# EAGLE board Patriot_78421-B (EAGLE 5.11), part 1 of 3
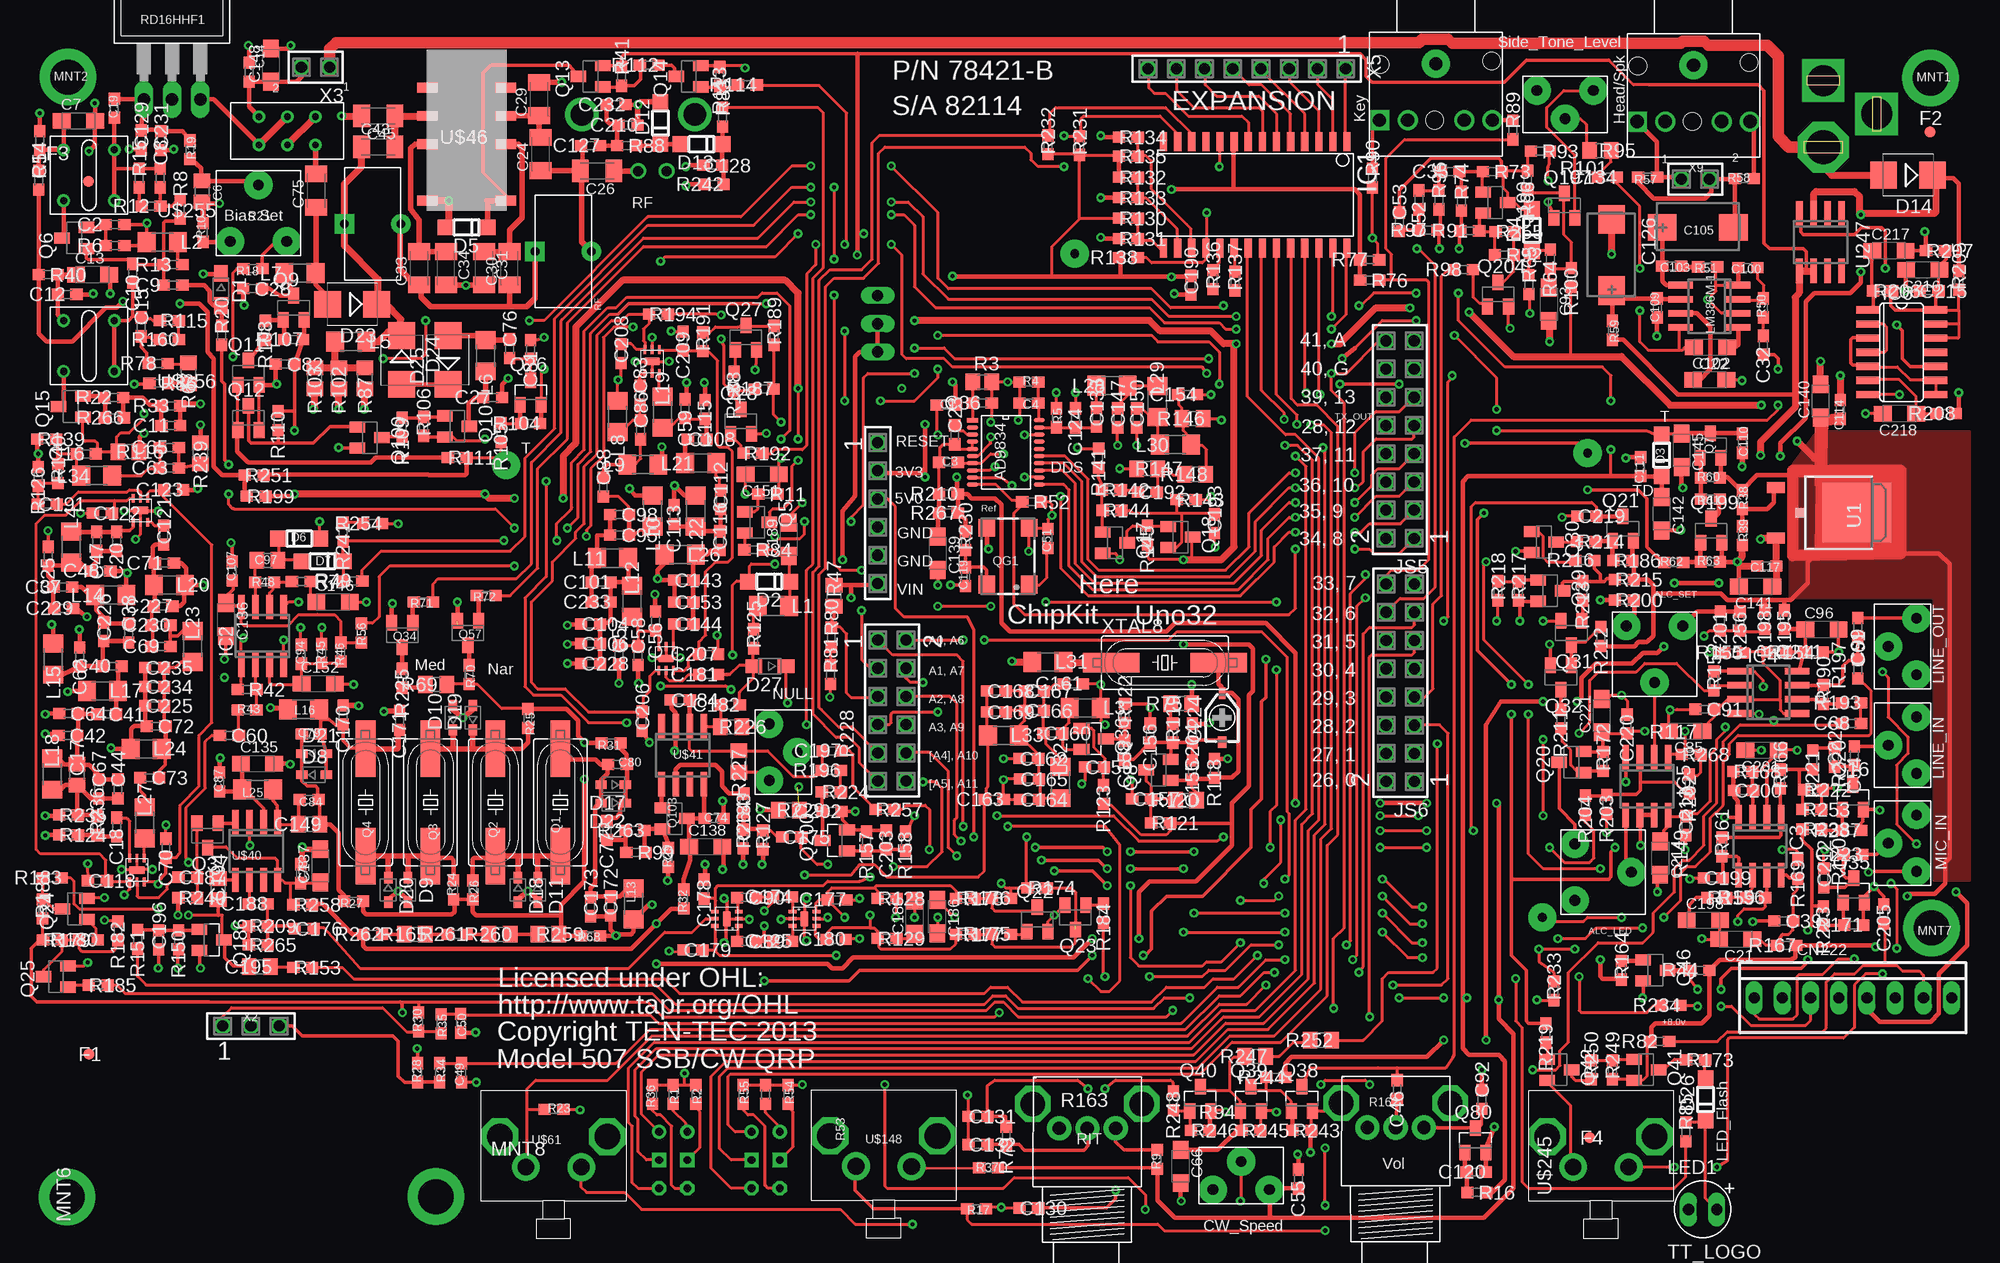
[diagram p2: board, top side]
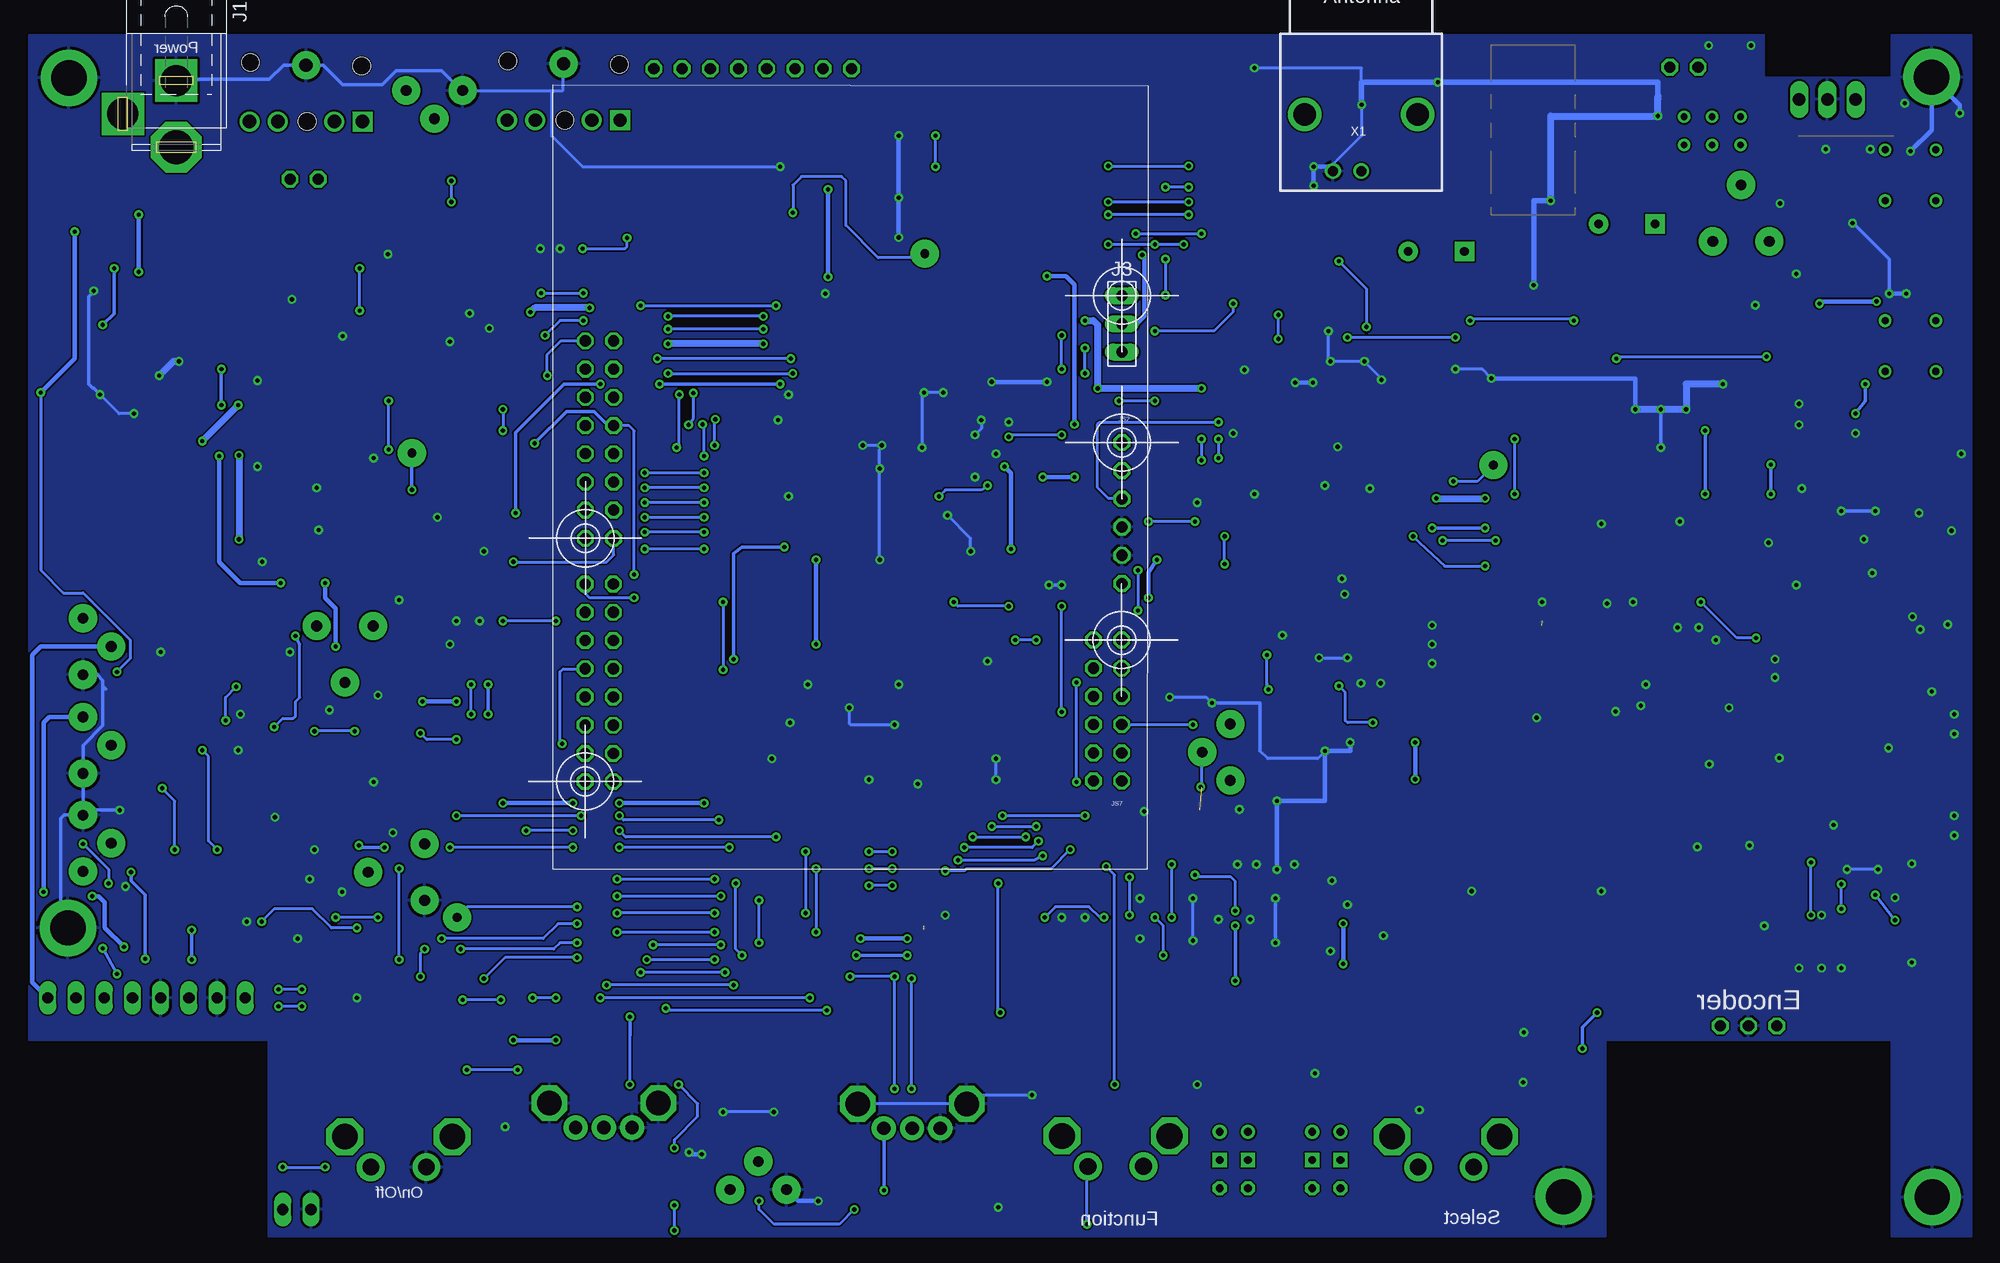
[diagram p3: board, bottom side, seen from below]

No outline drawn. Coordinates in mm, seen from the top.
Copper layers (1*16): Top 0.035mm / dielectric 1.5mm / Bottom 0.035mm
Design rules "default *": minimum track width 10mil, minimum drill 12mil, track to track 6mil, track to pad 6mil, pad to pad 6mil, via to via 6mil, smd to smd 6mil, copper to edge 6mil, drill to drill 8mil, minimum pad ring 10mil, minimum via ring 8mil, stop-mask expansion 4mil, vias tented up to drill 16mil, thermal gap 10mil

## Footprints (pad centres in the part's own frame; a part is rotated, then mirrored left to right if it is on the bottom)
0603 = smd 1.1 x 1: 1 -0.85,0; 2 0.85,0
0805 = smd 1.3 x 1.5: 1 -0.95,0; 2 0.95,0
SMC_A = smd 1.6 x 1.4: + -1.5,0; - 1.5,0
C1206K = smd 1.5 x 2: 1 -1.5,0; 2 1.5,0
POL-7343 = smd 2.6 x 2.4: + 3.2,0; - -3.2,0
CTRIMCTZ3 = smd 0.6 x 1.016: 1 0,2.204 | smd 0.78 x 1.016: 2 0,-2.204
MT8 = drill 1 long: 1 7.62,0; 2 5.08,0; 3 2.54,0; 4 0,0; 5 -2.54,0; 6 -5.08,0; 7 -7.62,0; 8 -10.16,0
SOD323-W = smd 1.5 x 1.2: A 1.45,0; C -1.45,0
SOD123 = smd 1.4 x 1.4: A 1.9,0; C -1.9,0
SOD323-R = smd 1.016 x 0.762: A 1.1,0; C -1.1,0
SMB = smd 2.4 x 2.4: A 2.2,0; C -2.2,0
FIDUCIAL-1MM = smd 1 x 1: FID 0,0
SO28W = smd 0.65 x 1.7: 1 -7.62,-4.78; 2 -6.35,-4.78; 3 -5.08,-4.78; 4 -3.81,-4.78; 5 -2.54,-4.78; 6 -1.27,-4.78; 7 0,-4.78; 8 1.27,-4.78; 9 2.54,-4.78; 10 3.81,-4.78; 11 5.08,-4.78; 12 6.35,-4.78; 13 7.62,-4.78; 14 8.89,-4.78; 15 8.89,4.78; 16 7.62,4.78; 17 6.35,4.78; 18 5.08,4.78; 19 3.81,4.78; 20 2.54,4.78; 21 1.27,4.78; 22 0,4.78; 23 -1.27,4.78; 24 -2.54,4.78; 25 -3.81,4.78; 26 -5.08,4.78; 27 -6.35,4.78; 28 -7.62,4.78
SO08 = smd 0.6 x 2.2: 1 -1.905,-2.6; 2 -0.635,-2.6; 3 0.635,-2.6; 4 1.905,-2.6; 5 1.905,2.6; 6 0.635,2.6; 7 -0.635,2.6; 8 -1.905,2.6
SO14 = smd 0.66 x 2.032: 1 -3.81,-3.073; 2 -2.54,-3.073; 3 -1.27,-3.073; 4 0,-3.073; 5 1.27,-3.073; 6 2.54,-3.073; 7 3.81,-3.073; 8 3.81,3.073; 9 2.54,3.073; 10 1.27,3.073; 11 0,3.073; 12 -1.27,3.073; 13 -2.54,3.073; 14 -3.81,3.073
SPC4077 = drill 2.794 pad 3.81 square: 1 -3,0 | drill 2.8 pad 3.81 square: 2 0,-4.8 | drill 3.048 pad 4.572 octagon: 3 3,0
SOCKET-1X3-.1IN = drill 1.016 long: 1 -2.54,0; 2 0,0; 3 2.54,0
SSW-106-02-S-S = drill 1 pad 1.5 octagon: 1 -6.35,0; 2 -3.81,0; 3 -1.27,0; 4 1.27,0; 5 3.81,0; 6 6.35,0
SSW-108-02-S-D = drill 1 pad 1.5 octagon: 1 -8.89,-1.27; 2 -8.89,1.27; 3 -6.35,-1.27; 4 -6.35,1.27; 5 -3.81,-1.27; 6 -3.81,1.27; 7 -1.27,-1.27; 8 -1.27,1.27; 9 1.27,-1.27; 10 1.27,1.27; 11 3.81,-1.27; 12 3.81,1.27; 13 6.35,-1.27; 14 6.35,1.27; 15 8.89,-1.27; 16 8.89,1.27
SSW-106-02-S-D = drill 1 pad 1.5 octagon: 1 -6.35,-1.27; 2 -6.35,1.27; 3 -3.81,-1.27; 4 -3.81,1.27; 5 -1.27,-1.27; 6 -1.27,1.27; 7 1.27,-1.27; 8 1.27,1.27; 9 3.81,-1.27; 10 3.81,1.27; 11 6.35,-1.27; 12 6.35,1.27
1206 = smd 1.6 x 1.8: 1 -1.4,0; 2 1.4,0
LED-.1IN = drill 1.016 long: A 1.27,0; C -1.27,0
MOUNTINGHOLE-.125IN = drill 3.175 pad 5.08 round: MNT 0,0
PAD = drill 0.8 pad 2.54 round: P$1 0,0
SM49 = smd 5.08 x 1.778: 1 -4.826,0; 2 4.826,0
MIKE_SOT23 = smd 1 x 1.4: 1 -0.95,-1.1; 2 0.95,-1.1; 3 0,1.1
SOT23 = smd 1 x 1.4: 1 -0.95,-1.1; 2 0.95,-1.1; 3 0,1.1
SOT-23 = smd 1 x 1.4: 1 -0.95,-1.1; 2 0.95,-1.1; 3 0,1.1
CRYSTAL_SM77H = smd 1.6 x 1.5: 1 -2.55,-1.9; 2 2.55,-1.9; 3 2.55,1.9; 4 -2.55,1.9
R0805 = smd 1.3 x 1.5: 1 -0.85,0; 2 0.85,0
RVM-06-HP03-1 = drill 0.965 pad 2.54 round: 1 -2.54,-2.54; 2 0,2.54; 3 2.54,-2.54
RVM-06-VP01-1 = drill 0.965 pad 2.54 round: 1 -2.54,-1.27; 2 0,1.27; 3 2.54,-1.27
3RP/1610N = drill 1.2 pad 2.184 round: 1 -2.54,0; 2 0,0; 3 2.54,0 | drill 2.2 pad 3 octagon: 4 -4.91,2.2; 5 4.89,2.2
TO-220S = drill 1.118 long: 1 -3.81,-10.16; 2 -1.27,-10.16; 3 1.27,-10.16
TOROID = drill 0.8 pad 1.778 square: P$1 0,-2.54 | drill 0.8 pad 1.778 round: P$2 0,2.54
TO252 = smd 1 x 1.6: 1 -2.28,-5.039; 3 2.28,-5.039 | smd 0.025 x 0.025: 2 0,2.261 | smd 5.4 x 6.2: 4 0,2.261
IRF7319PBF = smd 0.6 x 2.2: 1 -1.905,-2.6; 2 -0.635,-2.6; 3 0.635,-2.6; 4 1.905,-2.6; 5 1.905,2.6; 6 0.635,2.6; 7 -0.635,2.6; 8 -1.905,2.6
AD9834 = smd 1 x 0.406: 1 -3,2.9; 2 -3,2.25; 3 -3,1.625; 4 -3,0.975; 5 -3,0.325; 6 -3,-0.325; 7 -3,-0.975; 8 -3,-1.625; 9 -3,-2.25; 10 -3,-2.9; 11 3,-2.9; 12 3,-2.25; 13 3,-1.625; 14 3,-0.975; 15 3,-0.325; 16 3,0.325; 17 3,0.975; 18 3,1.625; 19 3,2.25; 20 3,2.9
OUT_TRI = drill 0.6 round: CLF -1.27,2.54; CLS 1.27,2.54; GRF -1.27,0; GRS 1.27,0; RDF -1.27,-2.54; RDS 1.27,-2.54
LEEJ_P2RELAY = smd 0.889 x 1.854: 1 -6.35,-3.531; 3 -1.27,-3.531; 4 1.27,-3.531; 5 3.81,-3.531; 8 3.81,3.531; 9 1.27,3.531; 10 -1.27,3.531; 12 -6.35,3.531
TL1105JA = drill 1.5 pad 2.5 round: 1 -2.504,0; 2 2.494,-0.01 | drill 2.3 pad 3.3 octagon: 3 -4.843,2.741; 4 4.831,2.741
RF1200 = smd 0.762 x 0.305: GND -1.077,0; RF1 -1.077,0.65; RF2 -1.077,-0.65; RFC 1.077,0; VRF1 1.077,0.65; VRF2 1.077,-0.65 | smd 0.711 x 1.422: GNDPAD 0,0
35252 = drill 1.2 pad 1.778 square: 1 -5.08,5.08 | drill 1.2 pad 1.778 round: 2 -5.08,2.54; 3 -5.08,-2.54 | drill 1.2 round: 4 -5.08,-5.08 | drill 1.2 pad 2.54 round: 5 0,0 | hole 1.575: 0.254,-5.004; -0.076,5.004; -5.08,0.102
GYR_LED_TL = drill 0.7 pad 1.27 round: P$1 -1.27,2.54; P$2 1.27,2.54 | drill 0.7 pad 1.27 square: P$3 -1.27,0; P$4 1.27,0 | drill 0.7 pad 1.27 octagon: P$5 -1.27,-2.54; P$6 1.27,-2.54
BALUN = drill 0.635 round: P$1 -2.286,2.286; P$2 -2.286,-2.286; P$3 2.286,-2.286; P$4 2.286,2.286
AMP_227161 = drill 0.9 pad 1.27 round: 1 0,-5.08; 2 -2.54,-5.08 | drill 2 round: 3 -5.08,0; 4 5.08,0
SSW-103-02-S-S = drill 1 pad 1.5 octagon: 1 -2.54,0; 2 0,0; 3 2.54,0
SSW-101-02-S-D = drill 1 pad 1.5 octagon: 1 0,-1.27; 2 0,1.27
SSW-108-02-S-S = drill 1 pad 1.5 octagon: 1 -8.89,0; 2 -6.35,0; 3 -3.81,0; 4 -1.27,0; 5 1.27,0; 6 3.81,0; 7 6.35,0; 8 8.89,0

## Placement (x,y rotation side)
C1  .1uf  [0603]  82.87,75.06 0 top
C2  .01uf  [0603]  8.06,91.31 0 top
C3  .1uf  [0603]  83.06,69.91 0 top
C4  27pf  [0603]  90.3,75.25 180 top
C5  .1uf  [0603]  1.27,98.87 90 top
C6  .47uf  [0805]  15.89,94.29 270 top
C7  10uf  [SMC_A]  4.76,100.65 0 top
C8  .1uf  [0603]  12.13,95.5 270 top
C9  .1uf  [0603]  13.27,85.85 0 top
C10  .1uf  [0603]  9.65,86.93 90 top
C11  .01uf  [0603]  13.08,73.22 0 top
C12  .1uf  [0603]  3.75,85.03 0 top
C13  10uf  [SMC_A]  6.03,86.8 0 top
C14  .1uf  [0603]  20.12,105.04 90 top
C15  .1uf  [0603]  10.41,82.11 270 top
C16  .1uf  [0603]  5.46,70.68 0 top
C17  15pf  [0805]  4.64,41.78 270 top
C18  .1uf  [0603]  8.19,37.08 90 top
C19  .1uf  [0603]  8,101.79 90 top
C20  390pf  [0603]  8.19,62.8 90 top
C21  10uf  [SMC_A]  153.92,26.99 180 top
C22  10uf  [SMC_A]  151.64,80.26 180 top
C23  .01uf  [0603]  83.63,72.39 270 top
C24  820pf  [C1206K]  46.35,97.66 90 top
C25  10pf  [0603]  2.03,61.47 90 top
C26  0.01uf  [C1206K]  51.44,96.14 180 top
C27  .1uf  [0603]  42.04,75.76 0 top
C28  .1uf  [0603]  20.45,85.53 180 top
C29  820pf  [C1206K]  46.23,102.62 90 top
C30  680pf  [C1206K]  43.56,87.38 90 top
C31  680pf  [C1206K]  41.27,87.38 270 top
C32  .1uf  [0603]  156.4,80.45 90 top
C33  680pf  [C1206K]  35.43,87.38 90 top
C34  680pf  [C1206K]  37.85,87.38 270 top
C35  .01uf  [0603]  128.21,96.08 0 top
C36  .1uf  [0603]  86.11,75.25 0 top
C37  56pf  [0603]  3.37,58.67 0 top
C38  10pf  [0603]  9.27,54.55 270 top
C39  .1uf  [0603]  158.24,28.64 180 top
C40  18pf  [0603]  7.81,51.56 0 top
C41  180pf  [0603]  7.3,47.24 180 top
C42  180pf  [0603]  3.81,45.34 180 top
C43  820pf  [C1206K]  31.75,98.3 0 top
C44  120pf  [0603]  8.32,40.51 270 top
C45  820pf  [C1206K]  31.75,101.09 180 top
C46  .1uf  [0603]  123.44,13.46 90 top
C47  56pf  [0603]  6.41,62.8 90 top
C48  12pf  [0603]  6.79,60.13 0 top
C49  .047uf  [0603]  39.24,14.99 270 top
C50  .047uf  [0603]  39.15,19.43 270 top
C51  .1uf  [0603]  92.01,63.06 90 top
C52  .01uf  [0603]  125.41,93.54 90 top
C53  .01uf  [0603]  123.63,91.57 270 top
C54  .1uf  [0603]  164.59,43.5 90 top
C55  .1uf  [0603]  114.55,5.4 90 top
C56  68pf  [0603]  56.71,55.63 90 top
C57  68pf  [0603]  53.4,52.58 270 top
C58  3.3pf  [0603]  55.12,52.51 270 top
C59  47pf  [0603]  59.37,74.74 90 top
C60  .1uf  [0603]  18.35,45.34 180 top
C61  .1uf  [0603]  164.91,51.31 270 top
C62  56pf  [0603]  4.89,52.39 90 top
C63  56pf  [0603]  12.95,69.41 0 top
C64  180pf  [0603]  3.87,47.31 180 top
C65  47pf  [0603]  12.95,71.25 0 top
C66  1uf  [SMC_A]  103.95,6.54 270 top
C67  330pf  [0603]  6.6,40.51 270 top
C68  .1uf  [0603]  164.34,46.42 0 top
C69  10pf  [0603]  12.19,53.34 0 top
C70  100pf  [0603]  12.64,35.18 90 top
C71  1000pf  [0603]  12.51,60.83 0 top
C72  330pf  [0603]  11.75,46.16 180 top
C73  27pf  [0603]  11.18,41.53 180 top
C74  .1uf  [0603]  61.98,37.85 0 top
C75  0.01uf  [C1206K]  26.16,94.36 90 top
C76  .1uf  [0603]  43.56,80.14 270 top
C77  .1uf  [0603]  52.32,36.77 90 top
C78  .1uf  [0603]  24.77,32.89 90 top
C79  68pf  [0603]  25.72,45.47 0 top
C80  82pf  [0603]  53.28,42.74 180 top
C81  .1uf  [0603]  45.47,80.07 90 top
C82  .1uf  [0603]  23.37,78.74 180 top
C83  .1uf  [0603]  55.31,75.95 270 top
C84  47pf  [0603]  25.53,39.56 0 top
C85  10uf  [SMC_A]  149.42,45.72 180 top
C86  3300pf  [0603]  55.37,72.83 270 top
C87  .1uf  [0603]  17.46,41.15 90 top
C88  470pf  [0603]  52.01,67.69 270 top
C89  .1uf  [0603]  64.9,26.8 180 top
C90  .1uf  [0603]  64.9,30.73 180 top
C91  .1uf  [0603]  151.13,47.69 180 top
C92  .1uf  [0603]  131.06,12.57 270 top
C93  10uf  [SMC_A]  137.1,84.14 270 top
C94  .1uf  [0603]  24.83,52.64 90 top
C95  470pf  [0603]  53.47,63.37 180 top
C96  10uf  [SMC_A]  161.67,54.86 0 top
C97  .47uf  [0805]  21.78,61.09 0 top
C98  10pf  [0603]  53.47,65.21 180 top
C99  .1uf  [0603]  164.91,55.05 90 top
C100  3300pf  [0603]  155,87.44 180 top
C101  120pf  [0603]  51.82,59.12 0 top
C102  1uf  [SMC_A]  151.57,77.34 0 top
C103  .047uf  [0603]  148.15,87.57 0 top
C104  1000pf  [0603]  50.86,55.37 180 top
C105  100uf  [POL-7343]  150.5,91.06 180 top
C106  270pf  [0603]  50.86,53.59 180 top
C107  .1uf  [0603]  18.61,60.13 90 top
C108  180pf  [0603]  60.45,72.01 180 top
C109  .1uf  [0603]  146.88,83.82 270 top
C110  .1uf  [0603]  154.5,71.63 270 top
C111  .1uf  [0603]  145.35,69.53 90 top
C112  18pf  [0603]  62.55,66.55 270 top
C113  56pf  [0603]  58.36,65.21 90 top
C114  .1uf  [0603]  163.32,74.68 90 top
C115  3.3pf  [0603]  61.15,74.68 90 top
C116  12pf  [0603]  62.48,62.87 270 top
C117  .1uf  [0603]  156.72,60.58 180 top
C118  100pf  [0603]  6.48,32.26 180 top
C119  .1uf  [0603]  84.58,59.63 270 top
C120  .1uf  [0603]  130.56,6.03 0 top
C121  1000pf  [0603]  12.45,63.37 270 top
C122  100pf  [0603]  6.92,65.34 180 top
C123  100pf  [0603]  13.34,67.44 0 top
C124  82pf  [0603]  94.49,73.91 90 top
C125  .1uf  [0603]  68.14,26.8 0 top
C126  220uf  [POL-7343]  142.75,88.58 270 top
C127  3.3pf  [0603]  50.86,98.42 0 top
C128  .1uf  [0603]  61.85,96.65 180 top
C129  12pf  [0603]  10.41,98.93 270 top
C130  .1uf  [0603]  90.3,2.79 180 top
C131  .1uf  [0603]  85.72,11.05 180 top
C132  .1uf  [0603]  85.72,8.51 180 top
C133  100pf  [0603]  96.39,73.98 270 top
C134  .1uf  [0603]  142.37,95.57 0 top
C135  10uf  [SMC_A]  20.89,42.8 0 top
C136  10uf  [SMC_A]  18.03,55.75 270 top
C137  10uf  [SMC_A]  26.54,33.59 90 top
C138  10uf  [SMC_A]  61.21,35.31 0 top
C139  10uf  [SMC_A]  82.11,61.72 270 top
C140  10uf  [SMC_A]  161.54,75.44 90 top
C141  10uf  [SMC_A]  155.7,58.74 180 top
C142  10uf  [SMC_A]  147.26,65.28 270 top
C143  56pf  [0603]  59.25,59.31 180 top
C144  3300pf  [0603]  59.25,55.37 180 top
C145  4.7uf  [SMC_A]  149.03,70.99 270 top
C146  10uf  [SMC_A]  27.69,57.34 0 top
C147  270pf  [0603]  98.3,73.91 270 top
C148  10uf  [SMC_A]  22.1,105.66 90 top
C149  15pf  [0805]  25.53,37.34 0 top
C150  100pf  [0603]  100.01,73.91 270 top
C151  10uf  [SMC_A]  66.29,68.83 180 top
C152  10uf  [SMC_A]  26.35,49.97 0 top
C153  18pf  [0603]  59.25,57.34 180 top
C154  120pf  [0603]  104.58,76.01 0 top
C155  47pf  [0603]  105.03,42.23 90 top
C156  47pf  [0603]  101.22,45.53 90 top
C157  .1uf  [0603]  100.46,39.62 180 top
C158  10pf  [0603]  98.93,44.01 90 top
C159  .1uf  [0603]  96.2,42.48 180 top
C160  .1uf  [0603]  92.46,45.53 180 top
C161  270pf  [0603]  94.3,49.97 0 top
C162  470pf  [0603]  90.3,43.24 180 top
C163  270pf  [0603]  87.19,39.56 0 top
C164  10pf  [0603]  90.36,39.56 180 top
C165  82pf  [0603]  90.36,41.4 180 top
C166  82pf  [0603]  90.81,47.56 180 top
C167  12pf  [0603]  90.81,49.34 180 top
C168  82pf  [0603]  87.38,49.34 180 top
C169  12pf  [0603]  87.38,47.43 180 top
C170  27pf  [0603]  28.57,47.18 90 top
C171  47pf  [0603]  33.66,46.67 90 top
C172  47pf  [0603]  52.64,29.97 270 top
C173  27pf  [0603]  50.86,29.91 270 top
C174  .1uf  [0603]  68.14,30.8 0 top
C175  .1uf  [0603]  68.96,36.2 180 top
C176  .1uf  [0603]  25.08,27.94 180 top
C177  100pf  [0603]  73.03,30.54 0 top
C178  100pf  [0603]  61.09,31.5 90 top
C179  100pf  [0603]  60.07,26.04 180 top
C180  100pf  [0603]  72.96,26.99 0 top
C181  .1uf  [0603]  61.47,50.8 0 top
C182  .1uf  [0603]  63.44,48.07 0 top
C183  .1uf  [0603]  64.64,39.24 90 top
C184  .01uf  [0603]  58.93,48.51 180 top
C185  4.7uf  [SMC_A]  80.01,28.96 90 top
C186  4.7uf  [SMC_A]  82.04,29.02 270 top
C187  .1uf  [0603]  14.61,32.58 180 top
C188  .1uf  [0603]  20.95,30.16 0 top
C189  1uf  [SMC_A]  68.71,62.99 90 top
C190  .1uf  [0603]  104.9,85.85 270 top
C191  .1uf  [0603]  1.97,66.17 180 top
C192  .01uf  [0603]  100.97,67.25 180 top
C193  .01uf  [0603]  107,64.39 270 top
C194  .47uf  [0805]  17.34,31.5 270 top
C195  .47uf  [0805]  21.08,24.51 0 top
C196  .1uf  [0603]  12,26.92 270 top
C197  .1uf  [0603]  72.58,43.94 0 top
C198  DNI  [SMC_A]  151,28.7 0 top
C199  DNI  [0603]  151.89,32.51 180 top
C200  .1uf  [0603]  154.62,40.39 180 top
C201  10uf  [SMC_A]  156.27,44.01 180 top
C202  DNI  [0603]  72.58,38.48 0 top
C203  DNI  [0603]  77.47,35.94 90 top
C204  47pf  [0603]  105.03,45.53 90 top
C205  .1uf  [0603]  167.26,29.27 90 top
C206  100pf  [0603]  55.5,46.61 270 top
C207  100pf  [0603]  61.47,52.64 0 top
C208  100pf  [0603]  53.59,79.69 270 top
C209  100pf  [0603]  59.18,80.84 90 top
C210  12pf  [0603]  54.23,100.27 0 top
C211  .1uf  [0603]  160.91,52.83 0 top
C212  .1uf  [0603]  161.86,32.51 270 top
C213  .1uf  [0603]  149.42,37.21 270 top
C214  10uf  [SMC_A]  147.13,34.29 270 top
C215  .1uf  [0603]  171.32,85.34 180 top
C216  10uf  [SMC_A]  170.75,87.25 180 top
C217  1uf  [SMC_A]  167.7,88.96 0 top
C218  1uf  [SMC_A]  168.66,74.3 180 top
C219  .01uf  [0603]  140.53,65.09 180 top
C220  .1uf  [0603]  144.15,46.35 90 top
C221  10uf  [SMC_A]  141.86,47.12 90 top
C222  .1uf  [0603]  162.81,43.37 270 top
C223  .1uf  [0603]  164.47,34.61 0 top
C224  2-10pf  [CTRIMCTZ3]  107.7,46.93 0 top
C225  1000pf  [0603]  11.62,48.01 180 top
C226  3.3pf  [0603]  7.05,54.67 270 top
C227  470pf  [0603]  12.38,56.96 0 top
C228  27pf  [0603]  50.86,51.82 180 top
C229  10pf  [0603]  3.43,56.77 0 top
C230  12pf  [0603]  12.19,55.24 0 top
C231  10pf  [0603]  12.19,98.87 270 top
C232  10pf  [0603]  53.15,102.11 0 top
C233  100pf  [0603]  51.82,57.34 0 top
C234  270pf  [0603]  11.62,49.72 180 top
C235  1000pf  [0603]  11.62,51.44 180 top
CN222  MT8  [MT8]  165.74,21.72 0 top
D1  BA595  [SOD323-W]  17.59,85.47 270 top
D2  MMSD914T1  [SOD123]  66.93,59.18 180 top
D3  MMSD914T1  [SOD123]  147.26,70.55 90 top
D4  MMSD914T1  [SOD123]  135.57,90.81 90 top
D5  MMSD914T1  [SOD123]  39.69,91.06 180 top
D6  MMSD914T1  [SOD123]  24.64,63.06 0 top
D7  MMSD914T1  [SOD123]  26.73,61.02 180 top
D8  BB132  [SOD323-R]  25.97,41.78 0 top
D9  BB132  [SOD323-R]  34.42,31.43 270 top
D10  BB132  [SOD323-R]  38.48,46.93 90 top
D11  BB132  [SOD323-R]  46.1,31.43 270 top
D12  MMSD914T1  [SOD123]  57.15,100.46 90 top
D13  MMSD914T1  [SOD123]  60.83,98.55 180 top
D14  1N4007  [SMB]  169.42,95.76 180 top
D17  BB132  [SOD323-R]  52.9,40.89 180 top
D18  BB132  [SOD323-R]  44.32,31.43 270 top
D19  BB132  [SOD323-R]  40.26,46.93 90 top
D20  BB132  [SOD323-R]  32.64,31.43 270 top
D21  BB132  [SOD323-R]  25.97,43.69 0 top
D22  BB132  [SOD323-R]  52.9,39.24 180 top
D23  1N4007  [SMB]  29.4,84.14 180 top
D24  1N4007  [SMB]  33.85,79.12 270 top
D25  1N4007  [SMB]  38.04,79.12 90 top
D26  MMSD914T1  [SOD123]  151.19,12.57 90 top
D27  BA595  [SOD323-W]  66.99,51.56 180 top
F1  FIDUCIAL1MM  [FIDUCIAL-1MM]  5.72,16.64 0 top
F2  FIDUCIAL1MM  [FIDUCIAL-1MM]  171.39,99.63 0 top
F3  FIDUCIAL1MM  [FIDUCIAL-1MM]  5.65,95.19 0 top
F4  FIDUCIAL1MM  [FIDUCIAL-1MM]  140.78,9.14 90 top
IC1  MCP23017SO  [SO28W]  111.32,93.98 180 top
IC2  LM358D  [SO08]  21.34,54.29 0 top
IC3  LM358D  [SO08]  156.08,35.37 180 top
IC4  LM358D  [SO08]  156.84,49.21 270 top
IC5  LM358D  [SO08]  145.92,40.77 180 top
IC6  4011D  [SO14]  168.85,79.82 270 top
J1  DC_IN  [SPC4077]  161.8,101.28 270 bottom
J3  CONNECTOR-3SOCKET-SIL3-.1IN  [SOCKET-1X3-.1IN]  76.69,82.38 270 bottom
JS2  SSW-106-02-S-S  [SSW-106-02-S-S]  76.69,65.35 270 top
JS5  SSW-108-02-S-D  [SSW-108-02-S-D]  123.7,71.96 90 top
JS6  SSW-108-02-S-D  [SSW-108-02-S-D]  123.73,50.06 90 top
JS7  SSW-106-02-S-D  [SSW-106-02-S-D]  77.97,47.57 270 top
L1  47uh  [1206]  67.31,56.96 180 top
L2  27uh  [1206]  12.32,89.73 180 top
L3  47uh  [1206]  95.38,47.82 180 top
L4  680nh  [1206]  4.13,62.29 270 top
L5  27uh  [1206]  29.27,80.77 180 top
L6  100uh  [1206]  41.4,79.5 90 top
L7  100uh  [1206]  24.7,86.93 0 top
L8  2.7uh  [1206]  53.28,74.04 90 top
L9  82uh  [1206]  55.56,69.72 0 top
L10  560nh  [1206]  56.45,65.53 90 top
L11  560nh  [1206]  52.83,61.28 0 top
L12  3.9uh  [1206]  54.61,57.4 270 top
L13  2.2uh  [1206]  54.74,30.16 270 top
L14  5.6uh  [1206]  7.68,57.98 0 top
L15  5.6uh  [1206]  2.48,52.2 90 top
L16  2.2uh  [1206]  25.02,47.69 180 top
L17  4.7uh  [1206]  6.92,49.34 180 top
L18  680nh  [1206]  2.41,41.85 270 top
L19  1.5uh  [1206]  57.34,74.42 270 top
L20  82nh  [1206]  12.95,58.86 180 top
L21  820nh  [1206]  60.77,69.85 0 top
L22  1.5uh  [1206]  60.33,65.53 90 top
L23  5.6uh  [1206]  15.05,53.34 270 top
L24  47nh  [1206]  10.86,44.13 180 top
L25  4.7uh  [1206]  20.89,40.45 0 top
L26  1.5uh  [1206]  58.93,61.59 180 top
L27  4.7uh  [1206]  10.73,37.47 270 top
L28  2.2uh  [1206]  97.79,76.83 0 top
L29  2.2uh  [1206]  101.85,75.37 270 top
L30  2.2uh  [1206]  103.5,71.5 0 top
L31  8.2uh  [1206]  92.01,51.94 180 top
L32  820nh  [1206]  93.15,41.08 270 top
L33  820nh  [1206]  88.01,45.34 180 top
L34  1.5uh  [1206]  6.41,68.71 0 top
LED1  TT_LOGO  [LED-.1IN]  150.94,2.67 0 top
LM386M-1  LM386M-1  [SO08]  151.54,83.96 90 top
MNT1  MOUNTINGHOLE.125IN  [MOUNTINGHOLE-.125IN]  171.45,104.52 0 top
MNT2  MOUNTINGHOLE.125IN  [MOUNTINGHOLE-.125IN]  3.81,104.58 0 top
MNT6  MOUNTINGHOLE.125IN  [MOUNTINGHOLE-.125IN]  3.75,3.78 90 top
MNT7  MOUNTINGHOLE.125IN  [MOUNTINGHOLE-.125IN]  171.55,28 0 top
MNT8  MOUNTINGHOLE.125IN  [MOUNTINGHOLE-.125IN]  36.93,3.81 0 top
P1  PAD  [PAD]  43.24,69.66 180 top
Q1  9.00mhz  [SM49]  48.13,39.31 270 top
Q2  9.00mhz  [SM49]  42.29,39.31 90 top
Q3  9.00mhz  [SM49]  36.45,39.31 270 top
Q4  9.00mhz  [SM49]  30.61,39.31 90 top
Q5  MMBT3904  [MIKE_SOT23]  65.85,64.52 270 top
Q6  MMBT3904  [MIKE_SOT23]  4.38,90.11 90 top
Q7  MMBT3906LT1  [SOT23]  151.64,71.44 0 top
Q8  MMBT3904  [MIKE_SOT23]  101.98,42.23 90 top
Q9  MMBT3906LT1  [SOT23]  24.13,83.82 0 top
Q10  MMBT3906LT1  [SOT23]  38.86,73.15 270 top
Q11  MMBT3904  [MIKE_SOT23]  20.07,77.98 0 top
Q12  MMBT3904  [MIKE_SOT23]  20.07,73.91 0 top
Q13  MMBT3906LT1  [SOT23]  50.86,104.65 90 top
Q14  MMBT3904  [MIKE_SOT23]  59.69,104.65 90 top
Q15  MMBT3904  [MIKE_SOT23]  4.06,74.93 90 top
Q16  2N7002_2  [SOT-23]  164.47,39.75 0 top
Q17  MMBT3904  [MIKE_SOT23]  98.04,62.67 270 top
Q18  MMBT3904  [MIKE_SOT23]  103.95,63.18 270 top
Q20  MMBT3906LT1  [SOT23]  139.13,42.93 90 top
Q21  MMBT3906LT1  [SOT23]  143.76,63.94 0 top
Q22  MMBT3904  [MIKE_SOT23]  91.06,28.77 0 top
Q23  MMBT3904  [MIKE_SOT23]  94.49,28.96 180 top
Q24  MMBT3904  [MIKE_SOT23]  4.45,29.72 90 top
Q25  MMBT3904  [MIKE_SOT23]  2.73,23.62 90 top
Q26  2N7002_2  [SOT-23]  45.47,76.2 0 top
Q27  MMBT3904  [MIKE_SOT23]  64.83,81.15 0 top
Q28  MMBT3904  [MIKE_SOT23]  64.39,73.6 0 top
Q29  MMBT3904  [MIKE_SOT23]  137.22,58.36 270 top
Q30  MMBT3904  [MIKE_SOT23]  136.65,62.74 270 top
Q31  MMBT3904  [MIKE_SOT23]  139.13,54.55 180 top
Q32  MMBT3904  [MIKE_SOT23]  138.18,50.55 180 top
Q34  MMBT3904  [MIKE_SOT23]  33.91,54.36 180 top
Q35  2N7002_2  [SOT-23]  164.53,31.37 0 top
Q36  SST5484  [SOT23]  96.14,45.02 270 top
Q37  MMBT3904  [MIKE_SOT23]  16.38,36.32 180 top
Q38  2N7002_2  [SOT-23]  114.87,12.64 0 top
Q39  2N7002_2  [SOT-23]  110.3,12.64 0 top
Q40  2N7002_2  [SOT-23]  105.73,12.64 0 top
Q41  MMBT3906LT1  [SOT23]  145.86,15.24 270 top
Q42  MMBT3904  [MIKE_SOT23]  138.05,15.24 270 top
Q46  MMBT3904  [MIKE_SOT23]  146.69,24.19 270 top
Q57  MMBT3904  [MIKE_SOT23]  39.81,54.55 180 top
Q80  2N7002_2  [SOT-23]  130.49,8.89 0 top
Q100  MMBT3904  [MIKE_SOT23]  30.99,72.14 270 top
Q103  MMBT3904  [MIKE_SOT23]  58.42,37.85 270 top
Q186  2N7002_2  [SOT-23]  16.76,26.92 270 top
Q190  MMBT3904  [MIKE_SOT23]  132.27,93.28 270 top
Q197  MMBT3904  [MIKE_SOT23]  138.49,93.03 0 top
Q199  MMBT3904  [MIKE_SOT23]  151.7,63.75 0 top
Q200  2N7002_2  [SOT-23]  72.83,35.88 90 top
Q204  MMBT3904  [MIKE_SOT23]  132.52,85.03 0 top
QG1  CRYSTAL_SM77H  [CRYSTAL_SM77H]  88.42,61.47 90 top
R1  180  [0603]  58.29,13.02 270 top
R2  180  [0603]  60.33,13.02 270 top
R3  6.8k  [R0805]  86.11,77.15 0 top
R4  220  [0603]  90.3,77.15 0 top
R5  220  [0603]  92.77,73.91 270 top
R6  10  [0603]  8.06,89.41 0 top
R7  2.2k  [0603]  24.83,59.18 180 top
R8  270  [0603]  13.91,92.71 270 top
R9  100  [0603]  101.85,7.18 90 top
R10  270  [0603]  15.98,90.6 270 top
R11  1k  [0603]  66.8,67.06 180 top
R12  100  [0603]  11.3,92.96 0 top
R13  100  [0603]  13.27,87.69 0 top
R14  68  [0603]  1.21,95.31 270 top
R15  150  [0603]  10.22,95.5 270 top
R16  10k  [0603]  130.62,4.19 180 top
R17  10k  [0603]  85.6,2.73 180 top
R18  470  [0603]  20.47,87.35 0 top
R19  220  [0603]  14.8,98.04 270 top
R20  220  [0603]  17.65,81.34 270 top
R21  1k_TP  [RVM-06-HP03-1]  20.96,92.34 0 top
R22  10  [0603]  7.94,75.76 0 top
R23  10k  [0603]  47.56,11.68 0 top
R24  100k  [0603]  38.54,31.43 270 top
R25  100k  [0603]  45.21,46.86 90 top
R26  100k  [0603]  40.26,31.43 270 top
R27  100k  [0603]  29.53,30.42 0 top
R28  10k  [0603]  35.31,14.99 90 top
R29  1.5k  [0603]  57.85,34.35 90 top
R30  10k  [0603]  35.37,19.56 90 top
R31  100k  [0603]  52.7,44.64 0 top
R32  470  [0603]  59.25,30.61 90 top
R33  100  [0603]  13.08,74.99 0 top
R34  100k  [0603]  37.27,14.99 270 top
R35  100k  [0603]  37.4,19.37 270 top
R36  180  [0603]  56.45,13.02 270 top
R37  4.7k  [0603]  86.68,6.41 180 top
R38  220  [0603]  154.5,66.55 270 top
R39  1.2k  [0603]  154.5,63.31 270 top
R40  100  [0603]  2.03,86.8 180 top
R41  10k  [0603]  53.66,104.65 270 top
R42  100k  [0603]  19.94,49.47 180 top
R43  10k  [0603]  19.94,47.62 0 top
R44  4.7k  [0603]  150.69,24.19 0 top
R45  100k  [0603]  26.67,52.7 90 top
R46  100k  [0603]  28.38,52.83 90 top
R47  12k  [0805]  72.77,57.91 270 top
R48  100k  [0603]  21.53,59.12 0 top
R49  10k  [0603]  29.46,59.25 0 top
R50  10k  [0603]  156.4,83.82 270 top
R51  10  [0603]  151.38,87.5 180 top
R52  DNI  [0603]  90.55,66.36 180 top
R53  180  [0603]  66.61,13.02 270 top
R54  180  [0603]  68.64,13.02 270 top
R55  180  [0603]  64.58,13.02 270 top
R56  100  [0603]  30.23,54.55 270 top
R57  100  [0603]  145.99,95.57 0 top
R58  100  [0603]  154.69,95.44 0 top
R59  10  [0603]  142.81,81.79 270 top
R60  1.5k  [0603]  151.64,68.52 0 top
R61  1.5k  [0603]  151.64,66.61 180 top
R62  1.5k  [0603]  148.34,60.9 0 top
R63  10k  [0603]  151.64,60.96 0 top
R64  10k  [0603]  137.22,88.2 90 top
R65  10k  [0603]  135.32,85.92 270 top
R66  10k  [0603]  135.19,95.31 90 top
R67  18  [0805]  14.67,77.91 90 top
R68  1M  [0603]  50.86,27.3 180 top
R69  12k  [0805]  36.96,49.91 0 top
R70  100  [0603]  39.94,50.8 270 top
R71  1k  [0603]  35.81,57.34 180 top
R72  1k  [0603]  41.47,57.91 180 top
R73  330k  [0603]  132.02,96.08 180 top
R74  100k  [0603]  129.22,93.41 270 top
R75  300  [0805]  104.01,48.2 0 top
R76  10k  [0603]  120.97,86.3 180 top
R77  10k  [0603]  120.97,88.14 0 top
R78  220  [0603]  11.94,78.8 0 top
R79  1k  [0603]  88.27,9.27 90 top
R80  1.5k  [0603]  72.52,54.17 270 top
R81  1.5k  [0603]  72.45,50.8 270 top
R82  100  [0603]  147.07,17.78 0 top
R83  10k  [0603]  62.74,100.97 270 top
R84  1k  [0603]  65.53,62.04 180 top
R85  180  [0603]  149.42,9.65 270 top
R86  270  [0603]  12,77.03 180 top
R87  560  [0805]  30.54,77.47 90 top
R88  1k  [0603]  54.1,98.42 180 top
R89  1k  [0603]  133.86,99.82 270 top
R90  1k  [0603]  121.22,95.5 270 top
R91  180  [0603]  129.98,90.74 0 top
R92  68  [0603]  133.1,88.58 180 top
R93  10k  [0603]  136.33,97.92 180 top
R94  10k_RT_TP  [RVM-06-VP01-1]  109.41,5.71 0 top
R95  47k  [0805]  141.73,97.98 180 top
R96  10k  [0603]  127.19,93.54 270 top
R97  10k  [0603]  126.24,90.81 0 top
R98  1k  [0603]  129.41,87.25 0 top
R99  100  [0603]  54.93,34.8 180 top
R100  100  [0603]  139.13,86.55 90 top
R101  1k_RT_TP  [RVM-06-VP01-1]  138.56,102.11 180 top
R102  560  [0805]  28.19,77.47 90 top
R103  560  [0805]  26.04,77.47 90 top
R104  1M  [0603]  45.47,73.41 0 top
R105  10k  [0603]  42.8,72.58 90 top
R106  10k  [0603]  35.81,73.15 270 top
R107  10k  [0603]  24.13,80.96 0 top
R108  10k  [0603]  21.59,81.79 90 top
R109  10k  [0603]  33.91,73.09 90 top
R110  10k  [0603]  22.73,73.66 90 top
R111  4.7k  [0603]  38.86,70.36 180 top
R112  10k  [0603]  56.13,105.66 0 top
R113  10k  [0603]  62.48,104.65 90 top
R114  1k  [0603]  64.96,103.89 0 top
R115  1k  [0603]  12.95,82.68 180 top
R116  5.6k  [0805]  9.27,70.87 180 top
R117  10k_TP  [RVM-06-HP03-1]  146.62,52.64 180 top
R118  10k  [0603]  107,42.35 90 top
R119  1.5k  [0603]  103.25,45.53 270 top
R120  15k  [0805]  104.46,39.5 0 top
R121  150  [0603]  102.17,37.47 180 top
R122  1M  [0603]  98.93,47.31 270 top
R123  220  [0603]  97.03,40.01 90 top
R124  100  [0603]  3.87,36.39 180 top
R125  1k  [0603]  65.53,54.04 270 top
R126  DNI  [0603]  1.14,68.64 90 top
R127  100  [0603]  66.36,35.94 270 top
R128  10  [0603]  77.53,30.67 180 top
R129  10  [0603]  77.53,27.05 180 top
R130  4.7k  [0603]  99.25,91.88 180 top
R131  0  [0603]  99.25,90.04 180 top
R132  4.7k  [0603]  99.25,95.57 180 top
R133  0  [0603]  99.25,93.73 180 top
R134  0  [0603]  99.25,99.19 180 top
R135  4.7k  [0603]  99.25,97.47 180 top
R136  DNI  [0603]  106.87,86.36 270 top
R137  DNI  [0603]  108.84,86.23 270 top
R138  4.7k  [0603]  99.25,88.33 0 top
R139  DNI  [0603]  1.91,72.01 180 top
R140  0  [0603]  2.92,68.9 270 top
R141  1k  [0603]  96.58,70.29 90 top
R142  1k  [0603]  97.73,67.44 180 top
R143  470  [0603]  104.46,66.55 180 top
R144  4.7k  [0603]  97.79,65.6 180 top
R145  1k  [0603]  100.97,63.37 90 top
R146  300  [0805]  105.03,73.85 0 top
R147  300  [0805]  100.97,69.34 180 top
R148  18  [0805]  105.28,68.83 0 top
R149  10k_TP  [RVM-06-HP03-1]  141.99,33.02 270 top
R150  100k  [0603]  13.78,26.92 90 top
R151  100k  [0603]  10.1,26.99 90 top
R152  100k  [0603]  151.96,50.23 270 top
R153  10k  [0603]  24.96,24.45 180 top
R154  10k  [0603]  157.61,52.83 180 top
R155  10k  [0603]  153.73,52.77 0 top
R156  0  [0603]  155.7,30.73 0 top
R157  100k  [0603]  75.69,35.81 90 top
R158  100k  [0603]  79.18,35.81 90 top
R159  DNI  [0603]  152.21,30.73 180 top
R160  2.2k  [0603]  12.95,80.96 0 top
R161  0  [0603]  152.65,35.31 270 top
R162  50k  [3RP/1610N]  123.32,10.03 0 top
R163  50k  [3RP/1610N]  95.57,9.97 0 top
R164  1k  [0603]  143.64,24.19 270 top
R165  12k  [0805]  35.05,27.43 0 top
R166  100k  [0603]  157.92,41.4 270 top
R167  100  [0603]  158.5,26.42 0 top
R168  100k  [0603]  154.56,42.1 180 top
R169  100k  [0603]  159.51,33.27 90 top
R170  10k_RT_TP  [RVM-06-VP01-1]  168.91,35.62 90 top
R171  1M  [0603]  164.53,28.26 0 top
R172  10k  [0603]  141.99,42.99 270 top
R173  470  [0603]  150.3,16.13 180 top
R174  1k  [0603]  91.06,31.62 180 top
R175  1k  [0603]  87.82,27.43 0 top
R176  1k  [0603]  87.82,30.67 0 top
R177  1k  [0603]  84.58,27.43 180 top
R178  1k  [0603]  84.58,30.67 180 top
R179  1k  [0603]  2.41,26.92 180 top
R180  1k  [0603]  5.65,26.92 0 top
R181  1k  [0603]  1.52,29.72 270 top
R182  1k  [0603]  8.32,27.75 90 top
R183  1k  [0603]  2.41,32.51 0 top
R184  1k  [0603]  97.03,29.34 90 top
R185  1k  [0603]  6.54,22.86 180 top
R186  10k  [0603]  143.76,61.09 180 top
R187  1k  [0603]  66.48,76.52 0 top
R188  1k  [0603]  63.75,77.22 90 top
R189  1k  [0603]  67.37,81.34 270 top
R190  100k  [0603]  161.8,49.02 270 top
R191  1k  [0603]  60.96,80.77 270 top
R192  1k  [0603]  65.47,70.74 180 top
R193  10k  [0603]  164.34,48.26 0 top
R194  1k  [0603]  56.96,83.25 180 top
R195  100  [0603]  158.31,55.75 90 top
R196  100k  [0603]  72.52,42.16 0 top
R197  10k_RT_TP  [RVM-06-VP01-1]  168.91,53.34 90 top
R198  100  [0603]  156.53,55.75 90 top
R199  DNI  [0603]  20.76,66.87 180 top
R200  2.2k  [0603]  143.89,57.53 180 top
R201  100k  [0603]  152.53,55.63 90 top
R202  100k  [0603]  149.73,40.96 90 top
R203  10k  [0603]  142.3,39.12 90 top
R204  10k  [0603]  140.4,39.05 90 top
R205  0  [0603]  173.99,86.3 270 top
R206  100k  [0603]  167.13,85.34 180 top
R207  100k  [0603]  171.89,88.96 180 top
R208  1M  [0603]  172.85,74.3 0 top
R209  100  [0603]  20.95,28.19 180 top
R210  10  [0603]  83.06,67.06 0 top
R211  10k  [0603]  138.18,46.8 90 top
R212  10k  [0603]  141.8,54.23 90 top
R213  1k  [0603]  140.14,58.36 90 top
R214  10k  [0603]  140.46,62.8 180 top
R215  10k  [0603]  143.89,59.37 180 top
R216  1k  [0603]  140.34,61.09 0 top
R217  10k  [0603]  134.37,58.36 270 top
R218  1k  [0603]  132.52,58.36 270 top
R219  1k  [0603]  136.84,18.54 90 top
R220  10k_RT_TP  [RVM-06-VP01-1]  168.91,44.45 90 top
R221  100k  [0603]  160.85,43.12 90 top
R222  100k  [0603]  160.91,40.45 180 top
R223  100k  [0603]  161.8,29.08 90 top
R224  330k  [0603]  72.52,40.26 180 top
R225  10k  [0603]  33.91,50.48 90 top
R226  47k  [0805]  63.5,46.1 180 top
R227  47k  [0805]  64.2,42.99 90 top
R228  100k_RT_TP  [RVM-06-VP01-1]  68.2,43.81 270 top
R229  470k  [0805]  68.71,38.61 180 top
R230  10  [0603]  84.58,62.87 270 top
R231  2.2k  [0603]  94.87,98.42 270 top
R232  2.2k  [0603]  92.01,98.49 270 top
R233  10k  [0603]  137.54,22.35 270 top
R234  1k  [0603]  148.08,21.02 0 top
R235  100  [0603]  3.87,38.16 180 top
R236  150  [0603]  6.41,37.21 270 top
R237  1M  [0603]  164.34,36.77 0 top
R238  100k  [0603]  160.78,36.89 180 top
R239  3.3  [0805]  15.75,70.74 90 top
R240  1.5k  [0603]  14.61,30.73 180 top
R241  100k  [0603]  28.57,63.63 90 top
R242  1M  [0603]  61.98,94.93 0 top
R243  1M  [0603]  114.87,9.78 180 top
R244  1M  [0603]  112.52,14.54 0 top
R245  100k  [0603]  110.3,9.78 180 top
R246  1M  [0603]  105.73,9.78 180 top
R247  15k  [0805]  110.68,16.45 0 top
R248  100k  [0603]  103.31,12.45 90 top
R249  10k  [0603]  142.81,15.24 270 top
R250  10k  [0603]  140.91,15.24 270 top
R251  0  [0603]  20.57,68.77 180 top
R252  15k  [0805]  116.59,17.91 0 top
R253  100k  [0603]  160.78,38.67 180 top
R254  0  [0603]  31.24,64.39 0 top
R255  68  [0603]  133.16,90.68 180 top
R256  100k  [0603]  154.31,55.63 90 top
R257  470  [0603]  77.34,38.67 180 top
R258  470  [0603]  24.96,30.1 180 top
R259  12k  [0805]  47.05,27.43 180 top
R260  12k  [0805]  42.67,27.43 0 top
R261  10k  [0603]  38.86,27.43 0 top
R262  10k  [0603]  31.24,27.43 0 top
R263  100  [0603]  54.86,36.77 0 top
R264  100  [0603]  64.58,36 270 top
R265  100  [0603]  20.95,26.48 180 top
R266  10  [0603]  8,73.91 0 top
R267  10  [0603]  83.06,65.34 0 top
R268  47k  [0603]  149.92,43.62 180 top
RD16HHF1  TO220S  [TO-220S]  14.46,112.74 0 top
TOROID1  TOROIDWHITE  [TOROID]  48.39,88.9 270 top
TOROID2  TOROIDWHITE  [TOROID]  31.24,91.38 270 top
U1  LM1117DTX-ADJ  [TO252]  162.56,65.37 270 top
U247  IRF7319Pbf  [IRF7319PBF]  161.54,89.73 180 top
U$1  AD9834  [AD9834]  88.23,70.8 0 top
U$35  [CROSS_HAIR]  125,41.19 0 bottom
U$37  OUT_TRI  [OUT_TRI]  23.56,99.76 270 top
U$40  SA612  [SO08]  20.8,34.92 180 top
U$41  SA612  [SO08]  59.15,43.56 180 top
U$46  AXICOM  [LEEJ_P2RELAY]  39.69,99.82 90 top
U$60  [CROSS_HAIR]  76.69,84.92 0 bottom
U$61  TACT_SWITCH  [TL1105JA]  47.53,6.48 0 top
U$63  [CROSS_HAIR]  76.69,71.69 0 bottom
U$64  [CROSS_HAIR]  76.71,53.91 0 bottom
U$72  RF1200  [RF1200]  10.35,65.6 90 top
U$73  RF1200  [RF1200]  10.03,33.21 270 top
U$75  RF1200  [RF1200]  56.39,78.99 90 top
U$76  RF1200  [RF1200]  57.66,52.26 270 top
U$80  RF1200  [RF1200]  70.1,28.83 0 top
U$81  RF1200  [RF1200]  63.12,28.83 180 top
U$143  35252R  [35252]  126.94,105.79 90 top
U$148  TACT_SWITCH  [TL1105JA]  77.25,6.54 0 top
U$154  PAD  [PAD]  94.42,88.71 0 top
U$157  [CROSS_HAIR]  124.97,63.08 0 bottom
U$166  GYR_LED_TL  [GYR_LED_TL]  58.29,7.11 0 bottom
U$168  GYR_LED_TL  [GYR_LED_TL]  66.61,7.11 0 bottom
U$177  PAD  [PAD]  140.59,70.74 180 top
U$184  PAD  [PAD]  136.53,28.96 90 top
U$188  35252R  [35252]  150.11,105.66 90 top
U$245  TACT_SWITCH  [TL1105JA]  141.8,6.48 0 top
U$255  [BALUN]  5.71,95.76 180 top
U$256  [BALUN]  5.71,80.39 180 top
X1  1-227161-0  [AMP_227161]  55.15,101.22 0 bottom
X2  SSW-103-02-S-S  [SSW-103-02-S-S]  20.29,19.18 0 top
X3  SSW-101-02-S-D  [SSW-101-02-S-D]  26.1,105.47 90 top
X5  SSW-108-02-S-S  [SSW-108-02-S-S]  109.92,105.35 180 top
X9  SSW-101-02-S-D  [SSW-101-02-S-D]  150.29,95.4 270 top
XTAL8  9.00mhz  [SM49]  102.55,51.88 0 top

## Tracks (layer width: path | path; a pad name or v marks a point on that pad's centre or on a via)
+3.3_V
  Top 0.254: U$1.4 U$1.5 84.04,71.13 C23.2 82.59,71.54 82.3,71.25 82.3,70 C3.1 R210.1
  Top 0.406: C139.+ 82.11,65.24 R267.1 R210.1
+3.3V  (via drill 0.38 pad 0.64)
  Top 0.254: R232.2 94.81,97.64 R231.2 | R231.2 98.3,97.58 R135.2 | 94.87,91.82 R231.2 | 94.87,91.82 92.39,89.34 92.39,86.61 | R130.2 94.93,91.89 94.87,91.82 | R233.2 136.04,21.5 v136.02,21.53
  Top 0.305: R37.1 101.85,6.41 R9.1
  Top 0.406: R135.2 R132.2 | R138.1 98.55,88.18 98.55,86.68 98.49,86.61 | IC1.9 108.71,98.7 108.71,94.49 | C190.1 104.81,86.61 v103.12,86.61 98.49,86.61 | v103.12,94.49 108.71,94.49 | 108.71,94.49 119.63,94.49 120.12,94 R77.1 R76.2 | R9.1 101.85,3.49 103.44,1.91 112.01,1.91 | 112.01,1.91 112.01,4.38 R94.3 112.05,4.55 C55.1 | 112.01,1.91 131.25,1.91 133.92,4.57 133.92,18.48 132.59,19.81 v132.59,21.53 132.59,39.05 v132.4,39.24 | 98.49,86.61 92.39,86.61 83.5,86.61 v83.44,86.68 | 80.96,69.34 v80.96,73.34 | 80.96,69.34 80.58,68.96 76.89,68.96 JS2.2 | v80.96,68.58 80.96,69.34 | v126.11,39.24 v121.92,39.24 | v114.3,39.24 114.3,52.77 111.63,55.44 103.44,55.44 102.68,54.67 88.58,54.67 87.82,55.44 87.82,66.1 87.25,66.67 85.15,66.67 84.77,67.06 R210.2 | v83.82,68.58 83.82,67.14 R210.2 | R210.2 R267.2 84.01,65.34 84.58,64.77 R230.1
  Bottom 0.254: v132.59,21.53 v136.02,21.53
  Bottom 0.406: v103.12,86.61 v103.12,94.49 | v83.44,86.68 81.72,86.68 80.96,85.92 v80.96,73.34 | v132.4,39.24 v126.11,39.24 | v121.92,39.24 v114.3,39.24 | v83.82,68.58 v80.96,68.58
+5.0V  (via drill 0.38 pad 0.64)
  Top 0.254: R179.2 1.56,28.83 R181.2 | v85.34,36.2 85.34,54.86 84.77,56.01 79.06,56.01 78.3,56.77 78.3,65.91 77.58,66.62 JS2.3 | 88.58,31.62 88.2,31.62 v87.82,32 | 88.58,31.62 R174.2 90.11,31.73 v90.11,36.2 | R176.2 88.67,31.54 88.58,31.62 | v87.63,20.38 87.25,20 57.34,20 56.01,21.34 35.24,21.34 | 16.51,21.34 33.72,21.34 35.24,21.34 | R30.2 35.37,21.21 35.24,21.34 | R189.2 67.37,76.56 R187.2 67.33,74.21 v68.01,73.53
  Top 0.305: R179.2 1.27,26.92 0.51,26.16 0.51,21.84 1.02,21.34 16.51,21.34 | R28.2 35.31,17.08 v35.24,17.14 | v33.91,20.38 33.91,21.14 33.72,21.34
  Bottom 0.254: v90.11,36.2 v85.34,36.2 | v87.63,20.38 87.82,20.57 v87.82,32 | v68.01,73.53 78.68,73.53 78.87,73.34 78.87,67.63 77.92,66.67 76.74,66.67 JS2.3
  Bottom 0.305: v35.24,17.14 35.24,19.05 v33.91,20.38
  Bottom 0.406: JS2.3 76.64,66.67
+8.0V  (via drill 0.38 pad 0.64)
  Top 0.254: R145.1 100.97,61.53 101.16,61.15 v104.2,61.15 | Q18.3 104.97,63.1 104.97,61.15 | R100.1 139.06,85.64 139.06,79.44 | 160.97,70.3 161.68,70.3 | Q10.2 38.48,72.2 38.86,71.82 41.34,71.82 v41.34,72.01 | v69.53,76.58 v69.53,72.01 | R249.2 144.66,14.39 Q41.2 145.54,14.29 145.92,14.67 145.92,17.49 R82.1 | 102.87,37.62 R121.1 103.06,37.43 103.06,36.77 102.68,36.39 100.39,36.39 97.73,39.05 97.16,39.05 96.65,39.12 R123.1 | Q5.3 66.95,65.42 67.25,65.72 68.2,65.72 68.96,66.48 68.96,69.53 v69.53,70.1
  Top 0.305: Q10.2 35.91,72.2 R106.2 | 24.22,74.49 24.22,72.83 arc-45 v24.19,72.77 | 24.22,74.49 C82.1 | R110.2 24.16,74.51 arc-45 24.22,74.49 | 103.06,37.43 108.5,37.43 108.58,37.34
  Top 0.406: Q9.2 25.08,81.06 R107.2 C82.1 | Q7.2 152.59,68.62 R60.2 152.55,68.58 153.16,68.58 154.15,67.59 154.31,67.59 R38.1 154.5,67.44 155.83,68.77 161.35,68.77 161.54,68.96 | R215.1 144.8,59.44 | R215.1 144.74,60.96 R186.1 144.61,62.74 Q21.2 | R212.1 141.83,53.34 144.78,53.34 145.16,53.72 145.92,53.72 146.49,54.29 146.49,58.1 | v104.2,53.53 110.11,53.53 110.49,53.15 110.49,49.34 110.11,48.96 110.11,40.77 108.58,39.24 108.58,37.34 108.58,35.43 105.35,32.19 101.16,32.19 100.2,31.24 v100.2,27.05 | U1.4 161.64,62.2 161.55,62.1 160.4,60.95 160.4,59.05 158.88,57.53 158.31,57.53 | v169.35,30.86 169.54,31.05 171.83,31.05 172.78,32 172.78,33.91 173.16,34.29 173.16,60.77 172.21,61.72 168.78,61.72 | v56.77,24.77 72.2,24.77 72.58,24.38 73.53,24.38 74.49,25.34 94.3,25.34 v96.01,27.05 | v166.5,26.29 166.37,26.42 R167.2 159.26,26.31 159.26,25.34 158.84,25.11 158.39,25.11 157.67,25.15 152.49,25.15 R44.2 151.54,20.09 150.88,19.43 146.69,19.43 146.3,19.05 146.3,17.87 R82.1 | R199.1 24,66.86 v24.19,67.06 | 146.49,58.1 152.59,58.1 153.16,57.53 156.59,57.53 | R215.1 145.99,59.37 146.49,58.86 146.49,58.1 | 158.31,57.53 156.59,57.53 | 158.31,57.53 R195.2 | R198.2 156.53,57.47 156.59,57.53 | R258.1 25.8,30.16 26.73,30.16 29.46,27.43 R262.1 30.39,26.38 30.67,26.1 52.23,26.1 53.79,26.13 54.51,26.13 v56.77,28.38 58.1,29.72 59.21,29.72 R32.1
  Top 0.61: U1.4 163.32,66.87 | v156.21,75.06 148.02,75.06 143.64,79.44 139.06,79.44 133.92,79.44 v129.92,83.44 | v159.45,71.82 160.97,70.3 | v124.59,83.82 121.54,83.82 118.3,80.58 v117.54,80.58 | v104.2,61.15 104.97,61.15 107.63,61.15 108.78,62.29 108.78,80.39 v108.97,80.58 107.82,80.58 106.68,81.72 102.11,81.72 101.16,82.68 v80.01,82.68 | v69.53,76.58 69.53,85.15 68.39,86.3 53.72,86.3 49.53,82.11 49.53,71.76 arc-45 49.44,71.53 48.39,70.48 v48.39,66.67 | v24.19,67.06 v41.34,67.06 41.72,66.67 v44.01,66.67
  Top 1.016: 168.78,68.96 161.54,68.96 | 168.78,65.34 168.78,68.96 | 168.78,65.34 168.78,61.72 159.07,61.53 159.07,69.15 168.78,69.15 168.78,68.96 | U1.4 168.78,65.34 | C140.+ 161.54,68.01 168.21,68.01 168.21,62.48 161.64,62.2 | C114.1 161.73,73.72 161.68,70.3 161.55,62.1
  Bottom 0.254: v69.53,72.01 v69.53,70.1 | v41.34,67.06 v41.34,72.01
  Bottom 0.305: v24.19,67.06 v24.19,72.77
  Bottom 0.406: v104.2,53.53 v104.2,61.15 | v166.5,26.29 168.21,28 168.21,30.29 168.78,30.86 v169.35,30.86 | v56.77,28.38 v56.77,24.77 | v96.01,27.05 v100.2,27.05
  Bottom 0.61: v156.21,75.06 v159.45,71.82 | v129.92,83.44 129.54,83.82 v124.59,83.82 | v108.97,80.58 v117.54,80.58 | v80.01,82.68 79.25,82.68 78.87,82.3 v78.87,76.58 v69.53,76.58 | v48.39,66.67 v44.01,66.67
  pour Top: 161.23,72.71 175.01,72.71 175.01,32.26 171.7,32.26 171.7,57.66 158.75,57.66 158.75,69.34
+12V  (via drill 0.38 pad 0.64)
  Top 0.406: R205.1 173.99,95 173.48,95.5 172.04,95.5 171.96,95.42 | v165.16,87.06 165.16,86.11 164.21,85.15 160.97,85.15 160.21,84.39 160.21,73.91 157.92,71.63 v157.92,70.48 | v152.4,59.05 v148.4,59.05 | v147.45,53.34 146.88,52.77 145.54,52.77 144.59,51.82 141.35,51.82 140.02,50.48 140.02,48.77 v139.64,48.39 | v131.44,17.91 131.44,46.29 132.78,48.39 v136.59,48.39 | R244.2 113.37,15.84 113.92,16.38 126.11,16.38 v127.64,17.91
  Top 0.61: D14.C 171.96,95.42 171.96,92.46 171.83,92.33 165.29,92.33 v165.16,92.2 165.04,92.33 165.04,93.85 164.59,94.3 161.16,94.3 160.91,94.04 U247.3
  Bottom 0.406: v165.16,92.2 v165.16,87.06 | v157.92,70.48 157.92,60.96 156.02,59.05 v152.4,59.05 | v148.4,59.05 148.4,57.72 147.45,56.77 v147.45,53.34 | v139.64,48.39 v136.59,48.39 | v131.44,17.91 v127.64,17.91
+12V_SW  (via drill 0.38 pad 0.64)
  Top 0.254: 146.11,103.89 144.72,103.89 142.49,106.11 | v75.44,90.49 75.06,90.49 74.87,90.3 | v69.53,90.49 67.44,88.39 57.53,88.39 v57.15,88.01 | 74.49,58.86 74.4,58.95 | v54.67,82.11 52.96,82.11 52.01,81.15 52.01,70.48 50.86,69.34 50.86,64.2 50.48,63.82 v50.48,63.25 | v44.01,60.58 32.77,60.58 31.81,59.63 31.81,56.01 31.24,55.44 30.27,55.44 R56.1
  Top 0.305: Q13.2 53.75,105.6 R41.1 53.66,106.43 53.91,106.68 74.87,106.68 120.14,106.68 120.65,106.17 120.65,104.65 121.16,104.14 133.1,104.14 135.06,106.11 142.49,106.11 | 146.11,103.89 155.96,103.89 156.46,103.38 156.46,89.66 156.97,89.15 160.02,89.15 160.27,88.9 160.27,87.19 160.21,87.13
  Top 0.406: J3.2 J3.3 75.08,79.84 74.68,79.44 74.68,66.86 73.53,65.53 v73.53,61.15 | 74.87,106.68 74.87,90.3 v74.87,88.58 | v74.3,57.72 74.3,58.86 74.49,58.86 | 74.49,58.86 76.55,58.86 JS2.6 | 159.26,76.01 148.72,76.01 143.79,80.94 R59.2 | R47.1 74.48,58.86 74.49,58.86
  Top 0.61: 159.77,87.13 U247.5 159.64,85.15 159.26,84.77 159.26,76.01 159.26,74.87 156.15,71.75 v156.15,70.55 | C141.+ 157.57,59.13 C117.1 157.52,61.01 U1.3 156.19,63.14 v156.15,62.99 | U247.6 160.21,87.13 159.77,87.13 | 159.77,87.13 159.77,87.12 160.27,87.12
  Bottom 0.254: v44.01,60.58 47.62,60.58 v50.48,63.25 | v75.44,90.49 v69.53,90.49 | v54.67,82.11 54.67,85.53 v57.15,88.01
  Bottom 0.406: J3.2 75.35,82.39 74.68,83.06 74.68,88.39 v74.87,88.58 | v73.53,61.15 74.3,60.01 v74.3,57.72
  Bottom 0.61: v156.15,70.55 v156.15,62.99
+13V
  Top 0.61: D14.A 162.56,95.76 161.8,96.52 J1.3
  Top 1.016: X3.1 27.37,107.12 27.94,107.7 125.41,107.7 125.73,108.01 128.02,108.01 128.4,107.63 148.97,107.63 149.16,107.82 151.07,107.82 151.45,107.44 156.78,107.44 157.73,106.49 157.73,99.25 158.69,98.3 161.78,98.3 J1.3
AGC
  Top 0.254: R84.1 67.31,62.04 67.82,61.53 68.67,61.53 C189.+ 68.77,61.43 68.77,59.24 D2.C 68.83,57.08 L1.1
ALC_FLASH
  Top 0.254: Q42.1 136.95,17.84 R219.1
AUDIO_IN  (via drill 0.38 pad 0.64)
  Top 0.254: C61.2 165.1,50.35 166.12,49.34 166.12,45.53 165.93,45.34 154.11,45.34 153.35,44.58 153.35,43.62 152.78,43.05 152.78,39.05 151.64,37.91 151.64,34.86 150.3,33.53 149.54,33.53 148.97,32.96 148.97,30.48 v147.45,28.96 | JS7.2 84,53.92 v84.39,53.91 | 136.59,29.02 U$184.P$1 136.91,28.57 140.21,28.57 140.59,28.96 v143.64,28.96 | v86.3,53.91 102.87,53.91 103.63,54.67 111.25,54.67 113.54,52.39 113.54,38.48 113.73,38.29 113.73,32.77 v113.35,32.38 | v122.11,32.38 122.3,32.38 124.78,29.91 v125.73,29.91
  Bottom 0.254: v84.39,53.91 v86.3,53.91 | v113.35,32.38 v122.11,32.38 | v125.73,29.91 135.57,29.91 U$184.P$1 | v143.64,28.96 v147.45,28.96
BAND_END_FLASH_LED  (via drill 0.38 pad 0.64)
  Top 0.254: v125.73,25.34 124.4,25.34 v122.11,27.62 | JS7.10 79.29,43.81 81.34,43.81 83.06,42.1 83.06,35.24 v83.82,34.48 | v104.2,27.62 v113.35,27.62 | v134.11,23.43 134.11,19.62 134.68,19.05 134.68,5.14 135.25,4.57 148.4,4.57 149.42,5.59 R85.2
  Top 0.305: v91.44,34.1 96.58,34.1 v97.35,33.34 | v99.44,33.34 v104.2,33.34
  Bottom 0.254: v134.11,23.43 132.21,25.34 v125.73,25.34 | v113.35,27.62 v122.11,27.62 | v83.82,34.48 84.58,34.1 v91.44,34.1 | v97.35,33.34 v99.44,33.34 | v104.2,33.34 v104.2,27.62
BAND_SELECT  (via drill 0.38 pad 0.64)
  Top 0.254: R185.1 8.19,22.86 8.95,22.1 56.39,22.1 57.91,20.57 86.49,20.57 87.25,21.34 88.01,21.34 89.34,20 102.68,20 v103.25,20.57 | v77.92,89.53 78.87,88.58 78.87,79.63 79.25,79.25 82.68,79.25 83.44,78.49 105.92,78.49 v106.3,77.92 | v73.72,89.53 73.91,89.72 73.91,101.35 71.44,103.82 65.87,103.82 R114.2 | JS5.16 121.81,80.85 118.87,77.92 v117.54,77.92 117.54,76.39 118.68,75.25 118.68,28 117.73,27.05 v117.73,20.77 | v71.12,89.53 71.12,87.69 70.29,86.87 70.29,71.44 69.91,71.06 67.44,71.06 67.06,70.67 66.38,70.67 R192.1
  Bottom 0.254: v117.54,77.92 v106.3,77.92 | v77.92,89.53 v73.72,89.53 v71.12,89.53 | v103.25,20.57 117.54,20.57 v117.73,20.77
BATTERY
  Top 0.254: 72.58,55.08 73.32,55.08 73.91,54.48 73.91,49.15 74.3,48.77 76.63,48.77 JS7.5
  Top 0.305: R47.2 72.77,56.01 72.58,55.82 72.58,55.08 R80.1
BIAS
  Top 0.254: IC4.5 158.24,47.31 157.92,47.62 157.92,48.58 | R155.2 154.65,52.83 R154.2 156.4,52.81 156.4,51.82 157.92,50.29 157.92,48.58 | 157.92,48.58 IC4.3 153.16,48.58 152.21,47.62 152.04,47.62 C91.1 152.02,47.65 152.02,47.05 151.49,46.52 C85.+
BLN16
  Top 0.406: C7.+ 3.43,100.48 U$255.P$3 1.29,98.04 C5.1 1.21,97.96 R14.1
CW  (via drill 0.38 pad 0.64)
  Top 0.254: C219.1 141.38,65.89 140.97,66.29 130.49,66.29 130.11,65.91 130.11,36.96 v130.3,36.77 | R158.2 79.34,36.66 v80.01,38.1 | v121.92,36.77 v126.11,36.77 | v87.44,38.1 97.92,38.1 100.2,35.81 107.25,35.81 v107.82,36.2
  Top 0.406: Q21.3 141.42,65.04 C219.1
  Bottom 0.254: v80.01,38.1 v87.44,38.1 | v126.11,36.77 v130.3,36.77 | v107.82,36.2 121.35,36.2 v121.92,36.77
CW_SPEED  (via drill 0.38 pad 0.64)
  Top 0.254: JS7.4 79.24,50.49 79.63,50.1 v80.77,50.1 | R94.2 109.41,3.49 v109.35,3.43 | v100.78,2.67 100.78,4 99.25,5.52 88.96,5.52 88.01,4.57 77.53,4.57 77.34,4.76 v77.34,13.91 | v78.11,33.53 81.15,33.53 82.49,34.86 82.49,40.58 81.92,41.15 v80.77,41.15
  Bottom 0.254: v109.35,3.43 109.35,2.67 108.01,1.33 102.11,1.33 v100.78,2.67 | v80.77,41.15 v80.77,50.1 | v77.34,13.91 77.34,32.77 v78.11,33.53
CW_SSB  (via drill 0.38 pad 0.64)
  Top 0.254: v128.4,77.72 128.4,77.53 128.02,77.15 128.02,56.01 v127.64,55.63 | R218.2 132.52,55.75 v132.4,55.63
  Bottom 0.254: v127.64,55.63 v132.4,55.63 | JS5.15 127.18,80.85 128.4,79.63 v128.4,77.72
DDS_LO_MIC_MUTE$TEST  (via drill 0.38 pad 0.64)
  Top 0.254: R44.1 149.84,23.33 v150.5,22.48
  Top 0.305: R238.2 159.93,35.9 160.78,35.05 160.78,30.1 | R223.2 161.76,29.97 160.91,29.97 160.78,30.1 | 160.78,30.1 160.78,28.19 v160.4,27.81 | v160.4,25.15 160.4,24.96 159.83,24.38 153.54,24.38 152.59,23.43 v152.59,22.48
  Top 0.406: Q46.3 R44.1
  Bottom 0.254: v150.5,22.48 v152.59,22.48
  Bottom 0.305: v160.4,25.15 v160.4,27.81
ENC_A  (via drill 0.38 pad 0.64)
  Top 0.254: v119.44,25.15 119.83,25.53 119.83,56.96 v120.59,57.72 | v113.35,25.15 111.63,25.15 109.16,22.67 107.25,22.67 104.01,19.43 56.96,19.43 56.2,20.19 39.24,20.19 C50.1 37.47,20.28 R35.1
  Bottom 0.254: JS6.15 125,58.13 124.59,57.72 v120.59,57.72 | v113.35,25.15 v119.44,25.15
ENC_B  (via drill 0.38 pad 0.64)
  Top 0.254: JS6.13 125,55.28 124.78,55.05 120.97,55.05 120.4,54.48 120.4,24.57 v120.02,24 | v112.39,24 111.44,24 109.35,21.91 107.44,21.91 104.39,18.86 56.2,18.86 53.15,15.81 53.12,15.84 C49.1 R34.1
  Bottom 0.254: v112.39,24 v120.02,24
FSEL  (via drill 0.38 pad 0.64)
  Top 0.254: U$1.9 87.79,68.55 v88.77,67.82 | v93.15,66.86 93.15,60.39 95.63,57.91 109.35,57.91 112.39,60.96 112.39,62.29 113.73,63.63 v114.3,63.63 | JS5.3 123.75,64.39 120.97,64.39 120.21,63.63 v119.63,63.63
  Bottom 0.254: v88.77,67.82 89.34,67.44 92.58,67.44 v93.15,66.86 | v114.3,63.63 v119.63,63.63
FSYNC  (via drill 0.38 pad 0.64)
  Top 0.254: U$1.15 93.54,70.48 95.63,68.39 95.63,61.15 96.58,60.2 108.01,60.2 110.11,62.29 110.11,65.34 113.73,68.96 v114.3,68.96 | JS5.11 124.92,75.77 123.64,74.49 121.54,74.49 119.63,72.58 v119.63,68.96
  Bottom 0.254: v114.3,68.96 v119.63,68.96
GND  (via drill 0.38 pad 0.41, 0.38 pad 0.64)  (1 unrouted)
  Top 0.254: v169.23,85.34 C215.2 | v168.66,76.01 IC6.7 | C218.- v165.61,74.3 | LM386M-1.2 152.64,83.33 v151.38,84.58 152.15,85.34 152.15,85.85 | LM386M-1.4 152.16,85.86 152.15,85.85 | 152.15,85.85 152.15,87.42 R51.1 | C102.- 154.43,77.34 v154.5,77.28 | v97.16,46.29 96.78,46.67 L3.1 v96.77,49.91 96.71,49.97 C161.2 | R36.1 R1.1 59.24,13.87 | 59.24,13.87 R2.1 | 64.52,14.12 R55.1 R53.1 R54.1 69.87,13.87 v69.91,13.91 | Q25.2 5.27,24.57 v5.59,24.89 | U$72.GNDPAD U$72.GND 10.35,63.44 v9.91,62.99 | C118.2 v5.59,33.78 | v7.11,30.73 5.61,30.73 Q24.2 | Q12.2 Q11.2 | C70.2 v12.64,37.27 | IC1.10 107.5,96.58 v107.44,96.52 | C207.2 62.32,54.27 v62.23,54.36 | U$76.GNDPAD 56.45,52.26 v56.39,52.32 | v58.93,52.32 57.66,52.32 U$76.GND | v54.86,78.99 U$75.GNDPAD | U$75.GNDPAD v57.91,78.99 | U$75.GNDPAD U$75.GND | Q204.2 133.47,82.11 v133.6,81.98 | v135.38,83.31 135.38,85 R65.2 | v8.64,33.27 8.45,33.21 U$73.GNDPAD U$73.GND | v11.43,33.27 10.16,33.27 | Q14.2 64.58,105.6 v64.77,105.41 | Q27.2 65.78,78.87 v65.66,78.23 | v142.3,36.58 R203.1 | IC4.4 155.96,47.31 v156.02,47.24 | C91.2 148.65,47.69 v148.02,47.62 147.92,47.52 C85.- | R168.2 153.92,42.32 | C220.2 144.15,48.45 v143.64,48.96 142.69,48.96 142.34,48.62 C221.- | C201.- v156.21,44.01 | C219.2 138.43,65.09 v138.3,64.96 | Q31.2 138.32,55.65 v136.59,55.63 | v84.77,12.95 84.88,12.85 C131.2 C132.2 | R243.1 115.72,11.44 Q38.2 117.71,11.54 R162.4 | R245.1 111.15,11.44 Q39.2 112.48,11.54 v112.58,11.43 | v108.01,11.43 107.82,11.62 106.76,11.62 Q40.2 | v59.31,14.92 59.31,13.93 59.24,13.87 | R209.2 v18.86,28.19 | v65.15,28.77 65.09,28.83 U$81.GND U$81.GNDPAD 63.06,28.77 | v68.01,28.77 68.07,28.83 U$80.GND 70.04,28.83 70.1,28.77